# EAGLE design Full_Spectrum_TVP (EAGLE 9.6.2)
COMPANY: ADAFRUIT INDUSTRIES; DRAWN: KTOWN; REV: A
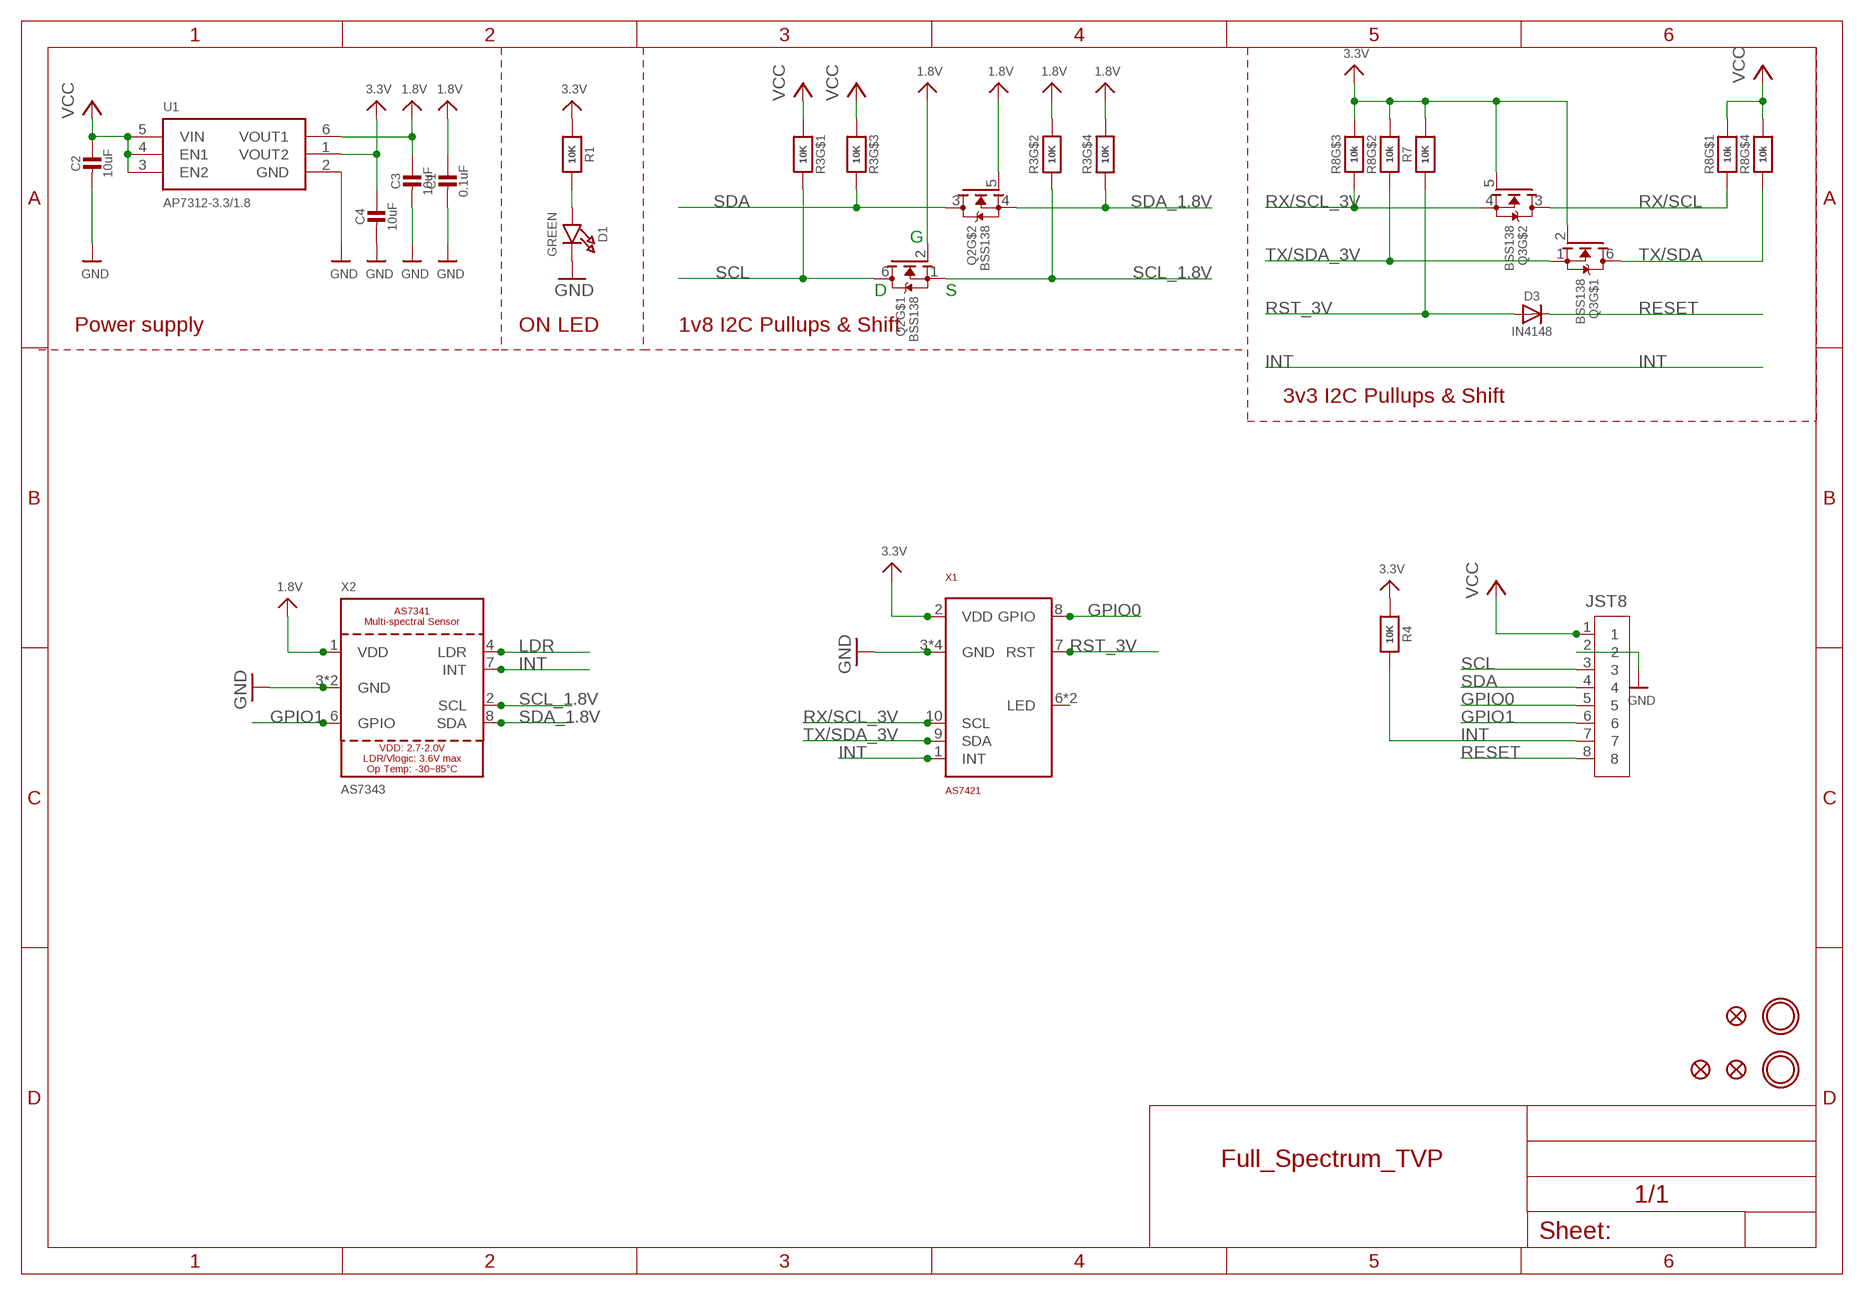
[diagram p0: schematic, sheet 1]

## Parts
C1  0.1uF  CAP_CERAMIC0603_NO  [0603-NO]
C2  10uF  CAP_CERAMIC0805-NOOUTLINE  [0805-NO]
C3  10uF  CAP_CERAMIC0805-NOOUTLINE  [0805-NO]
C4  10uF  CAP_CERAMIC0805-NOOUTLINE  [0805-NO]
D1  GREEN  LED0603_NOOUTLINE  [CHIPLED_0603_NOOUTLINE]
D3  IN4148  DIODESOD-323  [SOD-323]
FID1  FIDUCIAL_1MM  [FIDUCIAL_1MM]
FID3  FIDUCIAL_1MM  [FIDUCIAL_1MM]
FID4  FIDUCIAL_1MM  [FIDUCIAL_1MM]
Q2  BSS138  MOSFET-N_DUAL  [SOT363]
Q3  BSS138  MOSFET-N_DUAL  [SOT363]
R1  10K  RESISTOR_0603_NOOUT  [0603-NO]
R3  10K  RESISTOR_4PACK  [RESPACK_4X0603]
R4  10K  RESISTOR_0603_NOOUT  [0603-NO]
R7  10K  RESISTOR_0603_NOOUT  [0603-NO]
R8  10k  RESISTOR_4PACK_NO  [RESPACK_4X0603_NO]
SV1  JST8-2.0  [JST8-2.0]
U1  AP7312-3.3/1.8  VREG_SOT23-6_DUALAP7312  [SOT23-6]
U$1  MOUNTINGHOLE2.5  [MOUNTINGHOLE_2.5_PLATED]
U$17  MOUNTINGHOLE2.5  [MOUNTINGHOLE_2.5_PLATED]
X1  AS7421  [AS7421]
X2  AS7343  AS7341  [AS7341]

## Nets
1.8V [lowpower]: C1.1 C3.1 Q2.2(G) Q2.5(G) R3.2 R3.4 U1.6(VOUT1) X2.1(VDD)
3.3V: C4.1 Q3.2(G) Q3.5(G) R1.1 R4.1 R7.2 R8.6 R8.7 U1.1(VOUT2) X1.2(VDD)
GND [highpower]: C1.2 C2.2 C3.2 C4.2 D1.C SV1.2 U1.2(GND) X1.3(GND) X1.4(GND) X1.5(GND) X1.11(GND) X2.3(GND) X2.5(GND)
GPIO0: SV1.5 X1.8(GPIO)
GPIO1: SV1.6 X2.6(GPIO)
INT: R4.2 SV1.7 X1.1(INT) X2.7(INT)
LDR: X2.4(LDR)
N$1: D1.A R1.2
RESET: D3.C SV1.8
RST_3V: D3.A R7.1 X1.7(RST)
RX/SCL: Q3.3(D) R8.1
RX/SCL_3V: Q3.4(S) R8.3 X1.10(SCL)
SCL: Q2.6(D) R3.8 SV1.3
SCL_1.8V: Q2.1(S) R3.7 X2.2(SCL)
SDA: Q2.3(D) R3.6 SV1.4
SDA_1.8V: Q2.4(S) R3.5 X2.8(SDA)
TX/SDA: Q3.6(D) R8.4
TX/SDA_3V: Q3.1(S) R8.2 X1.9(SDA)
VCC [highpower]: C2.1 R3.1 R3.3 R8.5 R8.8 SV1.1 U1.3(EN2) U1.4(EN1) U1.5(VIN)
Unconnected: X1.6(LED) X1.12(LED)

## Notes on the sheet
- G
- D | S
- Power supply | ON LED | 1v8 I2C Pullups & Shift
- 3v3 I2C Pullups & Shift

## Library data of the parts
C1-C4 = microbuilder:CAP_CERAMIC: Ceramic Capacitors For new designs, use the packages preceded by an '_' character since they are more reliable: The following footprints should be used on most boards: _0402 - Standard footprint for regular board layouts _0603 - Standard footprint for regular board layouts _0805 - Standard footprint for regular board layouts _1206 - Standard footprint for regular board layouts For extremely tight-pitch boards where space is at a premium, the following 'micro-pitch' footprints can be used (smaller pads, no silkscreen outline, etc.): _0402MP - Micro-pitch footprint for very dense/compact boards _0603MP - Micro-pitch footprint for very dense/compact boards _0805MP - Micro-pitch footprint for very dense/compact boards _1206MP - Micro-pitch footprint for very dense/compact boards
D1 = microbuilder:LED: LED 0603 - 0603 Surface Mount Package 2mA: Green LED - Low Power (3.9mcd, 2ma, 1.7Vf) - Digikey: 475-2709-2-ND Orange LED - Low Power (9.8mcd, 2ma, 1.8Vf) - Digikey: 475-1194-2-ND Red LED - Low Power (5mcd, 2ma, 1.8Vf) - Digikey: 475-1195-2-ND Yellow LED - Low Power (7mcd, 2ma, 1.8Vf) - Digikey: 475-1196-2-ND 5mA: Blue LED - Low Power (17mcd, 5ma, 2.9Vf) - Digikey: LNJ937W8CRACT-ND 0805 - 0805 Surface Mount Package 2mA: Red LED (8.8mcd, 2mA, 1.8Vf, Clear) - Low Power [Digikey: 475-2510-1-ND] Green LED (5mcd, 2mA, 1.8Vf, Clear) - Low Power [Digikey: 475-2730-1-ND] Yellow LED (11.3mcd, 2mA, 1.8Vf, Clear) - Low Power [Digikey: 475-2555-1-ND] 20mA: Red LED (104mcd, 20mA, Diffused) - LS R976 [Digikey: 475-1278-6-ND] Red LED (12mcd, 20mA, 2.0Vf, Clear) - APT2012EC [Digikey: 754-1128-1-ND] Green LED (15mcd, 20mA, 2.2Vf, Clear) - APT2012GC [Digikey: 754-1131-1-ND] Orange LED (160mcd, 20mA, 2.1Vf, Clear) - APT2012SECK [Digikey: 754-1130-1-ND] 1206 - 1206 Surface Mount Package Green LED (26mcd, 20mA, Diffused) - LG N971 [Digikey: 475-1407-6-ND] Red LED (15mcd, 20mA, Diffused) - LH N974 [Digikey: 475-1416-6-ND] Cree - Cree High-Power Surface Mount LEDs XPEBWT-L1-0000-00D50 - White 111lm 350mA 2.9Vf 6200K 110° XTEAWT-00-0000-00000LEE3 - White 114lm 350mA 2.85Vf 5000K 115° Everlight - Everlight 45-21 Series Surface Mount LEDs 45-21/QK2C-B2832AC2CB2/2T - Warm White 2000mcd 20mA 3.25Vf 3050K 120° 45-21/LK2C-B38452C4CB2/2T - Nuetral White 2000mcd 20mA 3.25Vf 4150K 120° 45-21/LK2C-B50634C6CB2/2T - Cold White 2200mcd 20mA 3.25Vf 5650K 120° PLCC2 Reverse Mount LS T77K-J1L2-1-0-2-R18-Z - Red 11.25mcd 2mA 1.8Vf 630nm 120° LO T77K-L1M2-24-Z - Orange 19.6mcd 2mA 1.8Vf 606nm 120° LY T77K-K2M1-26-Z - Yellow 15.7mcd 2mA 1.8Vf 587nm 120°
D3 = microbuilder:DIODE: Diode SMA Model Volts Amps Type Vf Ir Digikey # Notes SSA34-E3 40V 3A Schottky 480mV @ 3A 200uA @ 40V SSA34-E3/61TGITR-ND CDBA120-G 20V 1A Schottky 500mV @ 1A 500uA @ 20V 641-1014-6-ND REEL MBRA210 10V 2A Schottky 350mV @ 2A 700uA @ 10V MBRA210LT3 SOD-123 Model Volts Amps Type Vf Ir Order # Notes BAT54T1G 30V 200mA Schottky 800mV @ 200mA 2uA @ 25V BAT54T1GOSTR-ND B0530W 30V 500mA Schottky 430mV @ 500mA 130uA @ 30V B0530W-FDICT-ND REEL MBR120 20V 1A Schottky 340mV @ 1A MBR120VLSFT1GOSCT-ND SOD-323 Model Volts Amps Type Vf Ir Order # Notes PMEG2005EJ 20V 500mA Schottky 355mV @ 500mA 568-4110-1-ND ZLLS410 10V 570mA Schottky 380mV @ 570mA ZLLS410CT-ND 1N4148WS 75V 150mA Silicon/Simple 1V 1N4148WSFSCT-ND REEL SOD-523 Model Volts Amps Type Vf Ir Order # Notes BAT54XV2 30V 200mA Schottky 0.8V @ 100mA BAT54XV2CT-ND TB751S 30V 30mA Schottky RB751S-40TE61CT-ND SOT23-R/W (R = Solder Paste/Reflow Ovens, W = Hand-Soldering) Model Volts Amps Type Vf Ir Order # Notes BAT54FILM 40V 300mA Schottky 497-7162-1-ND POWERDI-5 Model Volts Amps Type Vf Ir Order # Notes PDS560 60V 5A Schottky 670mV @ 5A 150uA @ 60V PDS560DICT-ND
FID1 FID3 FID4 = microbuilder:FIDUCIAL: Fiducial Alignment Points Various fiducial points for machine vision alignment.; BOM: EXCLUDE
Q2 Q3 = microbuilder:MOSFET-N_DUAL: Dual N-Channel MOSFET SOT363 (2.0x1.25mm) 2N7002PS - 60V, 320mA [Digikey: 568-5984-1-ND]
R1 R4 = microbuilder:RESISTOR: Resistors For new designs, use the packages preceded by an '_' character since they are more reliable: The following footprints should be used on most boards: _0402 - Standard footprint for regular board layouts _0603 - Standard footprint for regular board layouts _0805 - Standard footprint for regular board layouts _1206 - Standard footprint for regular board layouts For extremely tight-pitch boards where space is at a premium, the following 'micro-pitch' footprints can be used (smaller pads, no silkscreen outline, etc.): _0402MP - Micro-pitch footprint for very dense/compact boards _0603MP - Micro-pitch footprint for very dense/compact boards _0805MP - Micro-pitch footprint for very dense/compact boards _1206MP - Micro-pitch footprint for very dense/compact boards
R3 R8 = microbuilder:RESISTOR_4PACK: Resistor Packs (4 resistors) 4 x 0603 10K 1/16W - Digikey: YC164J-10KCT-ND
R7 = microbuilder_09_Nov_2015:RESISTOR: Resistors For new designs, use the packages preceded by an '_' character since they are more reliable: The following footprints should be used on most boards: _0402 - Standard footprint for regular board layouts _0603 - Standard footprint for regular board layouts _0805 - Standard footprint for regular board layouts _1206 - Standard footprint for regular board layouts For extremely tight-pitch boards where space is at a premium, the following 'micro-pitch' footprints can be used (smaller pads, no silkscreen outline, etc.): _0402MP - Micro-pitch footprint for very dense/compact boards _0603MP - Micro-pitch footprint for very dense/compact boards _0805MP - Micro-pitch footprint for very dense/compact boards _1206MP - Micro-pitch footprint for very dense/compact boards
SV1 = Connector_USB:JST8-2.0
U1 = adafruit_power:VREG_SOT23-6_DUAL: Dual Output SOT23-6 Linear Regulators Diodes Inc. AP7312 - Dual 150mA LDO Linear Regulator 0.2V dropout, 150mA output, 2-6V Input AP7312-1833W6-7 - 1.8V/3.3V SOT23-6 (Digikey: AP7312-1833W6-7DICT-ND) MIC5320 - Dual 150mA ULDO Linear Regulator Ultra-low 35mV dropout at 150mA, 2.3-5.5V Input 3.3V/1.8V SOT23-6 (Digikey: 576-1658-1-ND) 3.3V/1.5V SOT23-6 (Digikey: 576-3483-1-ND)
U$1 U$17 = microbuilder:MOUNTINGHOLE: Mounting Hole For #2 screws (0.086"/2.18mm width, 0.094"/2.4mm hole) use 2.5mm; BOM: EXCLUDE
X1 = Spectroscopy:AS7421
X2 = adafruit_sensor:AS7341

## Net classes
1 highpower: width 0.305 mm, drill 0.483 mm
2 lowpower: width 0.254 mm, drill 0.483 mm

## Board
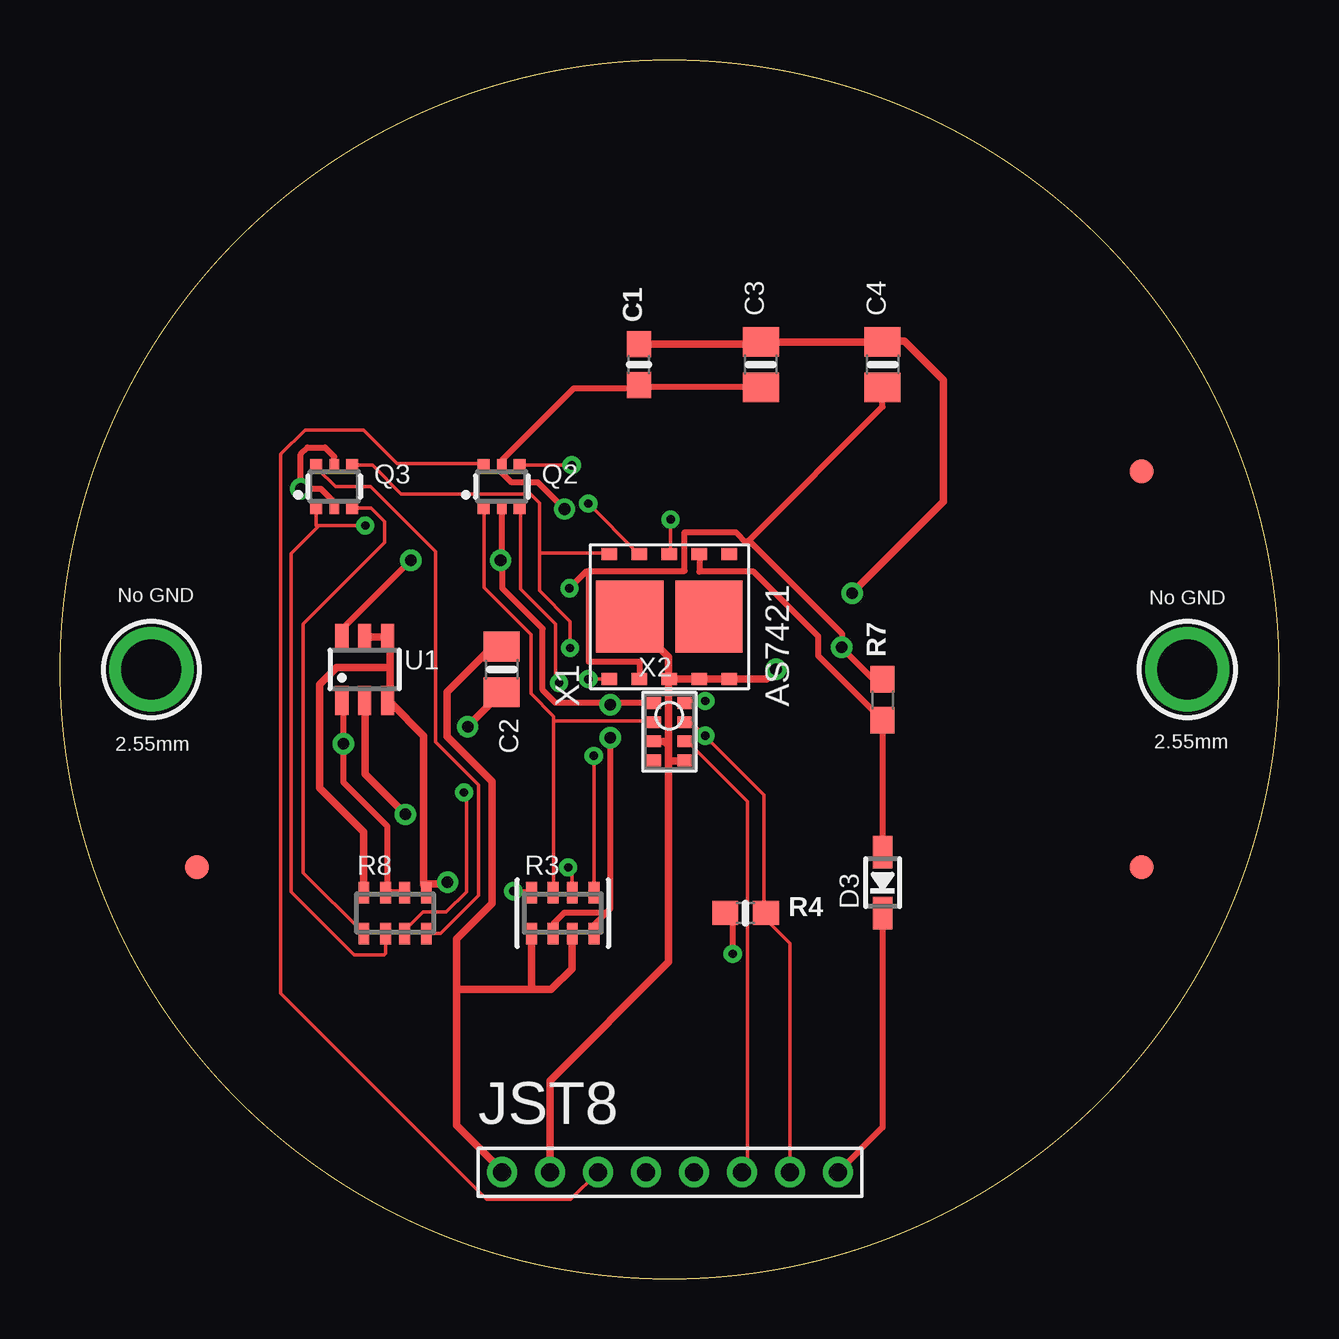
[diagram p1: board, top side]
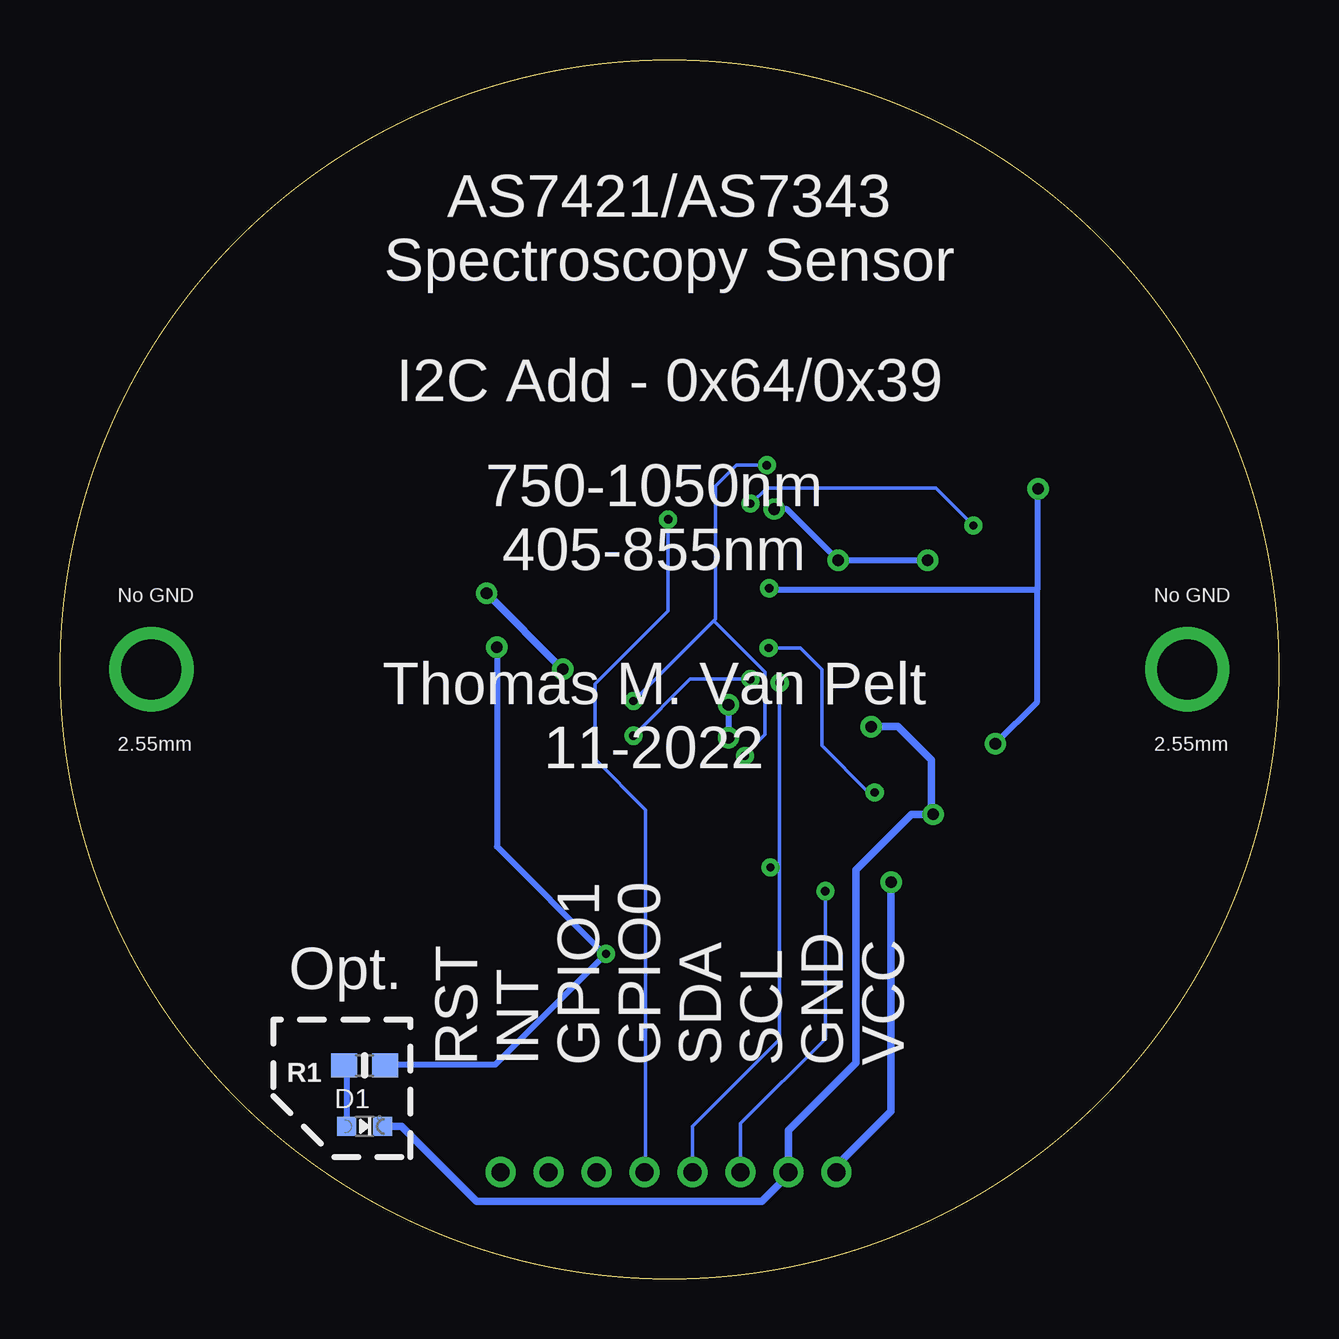
[diagram p2: board, bottom side, seen from below]

Size 50.8 x 50.8 mm. Coordinates in mm from the lower left corner, seen from the top.
Outline: circle at 25.4,25.4 radius 25.4
Copper layers (1*16): Top 0.035mm / dielectric 1.5mm / Bottom 0.035mm
Design rules "default": minimum track width 6mil, minimum drill 0.35mm, track to track 6mil, track to pad 6mil, pad to pad 6mil, via to via 6mil, smd to smd 6mil, copper to edge 40mil, drill to drill 6mil, minimum pad ring 10mil, minimum via ring 8mil, stop-mask expansion 4mil, vias tented up to drill 0mil, thermal gap 10mil

### Footprints (pad centres in the part's own frame; a part is rotated, then mirrored left to right if it is on the bottom)
0603-NO = smd 1.075 x 1: 1 -0.85,0; 2 0.85,0
0805-NO = smd 1.24 x 1.5: 1 -0.95,0; 2 0.95,0
CHIPLED_0603_NOOUTLINE = smd 0.8 x 0.8: A 0,-0.75; C 0,0.75
SOD-323 = smd 1.35 x 0.8: A 1.27,0; C -1.27,0
FIDUCIAL_1MM = smd 1 x 1: 1 0,0
SOT363 = smd 0.5 x 0.5: 1 -0.75,-0.9; 3 0.75,-0.9; 4 0.75,0.9; 6 -0.75,0.9 | smd 0.4 x 0.5: 2 0,-0.9; 5 0,0.9
RESPACK_4X0603 = smd 0.45 x 0.9: 1 -1.3,-0.85; 2 -0.4,-0.85; 3 0.4,-0.85; 4 1.3,-0.85; 5 1.3,0.85; 6 0.4,0.85; 7 -0.4,0.85; 8 -1.3,0.85
0603-NO' = smd 1.1 x 1: 1 -0.85,0; 2 0.85,0
RESPACK_4X0603_NO = smd 0.45 x 0.9: 1 -1.3,-0.85; 2 -0.4,-0.85; 3 0.4,-0.85; 4 1.3,-0.85; 5 1.3,0.85; 6 0.4,0.85; 7 -0.4,0.85; 8 -1.3,0.85
JST8-2.0 = drill 0.75: 1 0,7; 2 0,5; 3 0,3; 4 0,1; 5 0,-1; 6 0,-3; 7 0,-5; 8 0,-7
SOT23-6 = smd 0.55 x 1.2: 1 -0.95,-1.3; 2 0,-1.3; 3 0.95,-1.3; 4 0.95,1.3; 5 0,1.3; 6 -0.95,1.3
MOUNTINGHOLE_2.5_PLATED = drill 2.5 pad 3.2: P$1 0,0
AS7421 = smd 0.5 x 0.65: 1 -2.6,2.5; 2 -2.6,1.25; 3 -2.6,0; 4 -2.6,-1.25; 5 -2.6,-2.5; 6 2.6,-2.5; 7 2.6,-1.25; 8 2.6,0; 9 2.6,1.25; 10 2.6,2.5 | smd 3 x 2.8: 11 0,1.65; 12 0,-1.65
AS7341 = smd 0.575 x 0.488: 1 -0.635,1.2; 2 -0.635,0.4; 3 -0.635,-0.4; 4 -0.635,-1.2; 5 0.635,-1.2; 6 0.635,-0.4; 7 0.635,0.4; 8 0.635,1.2

### Placement (x,y rotation side)
C1  24.13,38.1 90 top
C2  18.41,25.4 270 top
C3  29.21,38.1 90 top
C4  34.29,38.1 90 top
D1  38.1,6.35 270 bottom
D3  34.29,16.51 90 top
FID1  45.09,17.14 0 top
FID3  5.71,17.14 0 top
FID4  45.09,33.66 0 top
Q2  18.41,33.02 0 top
Q3  11.43,33.02 0 top
R1  38.1,8.89 180 bottom
R3  20.95,15.24 0 top
R4  28.57,15.24 0 top
R7  10K  [0603-NO']  34.29,24.13 90 top
R8  13.97,15.24 0 top
SV1  25.43,4.45 90 top
U1  12.7,25.4 0 top
U$1  46.99,25.4 0 top
U$17  3.81,25.4 0 top
X1  25.4,27.6 90 top
X2  25.4,22.8 0 top

### Tracks (layer width: path | path; a pad name or v marks a point on that pad's centre or on a via)
1.8V  (via drill 0.48)
  Top 0.254: C3.1 29.18,37.19 24.38,37.19 C1.1 24,37.11 21.41,37.11 18.44,34.14 18.44,33.98 Q2.5 18.42,33.6 18.83,33.2 19.92,33.2 v21.03,32.08 | R3.2 20.57,14.4 20.57,14.81 21.03,15.26 22.74,15.26 22.76,15.24 | R3.4 22.25,14.4 22.25,14.63 22.2,14.68 22.76,15.24 | 22.94,24 X2.1 | 22.94,24 20.65,24 20.12,24.54 20.12,27.1 18.44,28.77 18.44,29.95 v18.36,29.95 18.41,30 Q2.2 | v14.63,29.95 11.81,27.13 11.81,26.75 U1.6 | 22.76,15.24 22.94,15.42 v22.94,22.55 | v22.94,23.93 22.94,24
  Bottom 0.254: v14.63,29.95 v18.36,29.95 20.5,32.08 v21.03,32.08 | v22.94,23.93 v22.94,22.55
3.3V  (via drill 0.35, 0.48)
  Top 0.152: R8.6 14.33,16.15 13.64,16.15 R8.7 13.64,16.23 | 11.81,24.08 U1.1 | 28.04,14.94 27.74,15.24 R4.1
  Top 0.254: 13.64,16.23 13.64,18.87 11.81,20.7 v11.81,22.3 11.81,24.08 | 28.04,14.94 v28.04,13.54 | R7.2 33.9,24.98 32.59,26.3 v32.59,26.31 32.59,26.91 32.58,26.91 28.71,30.77 | C4.1 34.29,36.35 28.71,30.77 | 28.71,30.77 28.61,30.67 28.17,31.11 26.04,31.11 26.04,29.5 26.03,29.5 22.05,29.5 | X1.2 24.15,25.72 22.05,25.72 22.05,29.5 | Q3.2 11.43,32.37 10.88,32.92 v10.03,32.92 10.03,34.37 10.31,34.65 11.05,34.65 11.43,34.27 Q3.5 | v21.23,28.78 21.95,29.5 21.95,29.39 22.05,29.5
  Bottom 0.152: 37.19,8.91 R1.1 | 28.12,13.54 v28.04,13.54
  Bottom 0.254: 10.07,28.73 10.07,24.04 v11.81,22.3 | v10.03,32.92 10.07,32.88 10.07,28.73 | 37.19,8.91 32.66,8.91 v28.04,13.54 | 28.12,13.54 32.59,18.01 v32.59,26.31 | 10.07,28.73 21.18,28.73 v21.23,28.78
GND  (via drill 0.48)
  Top 0.305: C4.2 34.14,39.09 34.29,39.09 | X1.3 25.45,24.99 26.59,24.99 X1.4 26.75,24.99 27.89,24.99 X1.5 29.45,25 v29.84,25.4 | 25.38,22.23 25.38,24.92 X1.3 | X1.3 25.38,25.15 25.38,25.91 23.7,27.58 X1.11 | v14.4,19.36 12.72,21.03 12.72,23.85 U1.2 | v16.99,23.01 18.36,24.38 C2.2 | v33.02,28.57 36.83,32.38 36.83,37.47 35.2,39.09 34.29,39.09 | 34.29,39.09 34.25,39.05 C3.2 29.11,38.95 C1.2 | 25.38,22.23 25.38,21.59 | X2.3 25.2,22.4 25.38,22.23 | X2.5 26.02,21.59 25.38,21.59 | SV1.2 20.43,8.26 25.38,13.2 25.38,21.59
  Bottom 0.305: D1.C 36.57,6.35 33.44,3.23 21.54,3.23 20.43,4.33 SV1.2 20.43,6.19 17.62,9 17.62,17.04 15.3,19.36 v14.4,19.36 14.48,19.43 14.48,21.62 15.87,23.01 v16.99,23.01 | v29.84,25.4 v33.02,28.57
GPIO0  (via drill 0.35)
  Top 0.152: v25.45,31.65 25.45,30.25 X1.8
  Bottom 0.152: v25.45,31.65 25.45,27.84 28.51,24.78 28.51,21.65 26.4,19.54 26.4,4.48 SV1.5
GPIO1
  Top 0.152: X2.6 26.06,22.33 26.21,22.33 28.65,19.89 28.65,4.67 SV1.6
INT  (via drill 0.35)
  Top 0.152: 26.88,22.62 29.34,20.16 29.34,15.32 | 26.88,22.62 26.36,23.14 26.09,23.14 26.06,23.16 X2.7 | 29.34,15.32 R4.2 | v22.02,24.99 22.86,24.99 X1.1 | 26.88,22.62 v26.9,22.63 | SV1.7 30.43,13.97 29.34,15.06 29.34,15.32
  Bottom 0.152: v22.02,24.99 24.54,24.99 v26.9,22.63
N$1
  Bottom 0.152: 38.86,8.76 38.94,8.84 R1.2 | 38.86,6.4 D1.A
  Bottom 0.254: 38.86,8.76 38.86,6.4
RESET
  Top 0.254: D3.C 34.29,6.3 SV1.8
RST_3V
  Top 0.254: D3.A R7.1 31.6,25.97 31.6,26.78 28.91,29.47 26.65,29.47 X1.7
RX/SCL
  Top 0.152: Q3.3 12.96,32.12 13.54,31.55 13.54,30.68 10.14,27.28 10.14,16.92 R8.1
RX/SCL_3V  (via drill 0.35)
  Top 0.152: Q3.4 12.19,33.91 13.03,33.91 14.23,32.71 19.61,32.71 19.98,32.34 19.98,30.2 | X1.10 22.86,30.25 20.04,30.25 19.98,30.2 | v16.84,20.27 16.94,20.17 16.94,16.13 16.1,15.29 15.14,15.29 14.4,14.55 14.4,14.4 R8.3 | v21.26,26.29 21.26,27.4 19.98,28.68 19.98,30.2
  Bottom 0.152: v16.84,20.27 17.09,20.27 19.05,22.23 19.05,25.4 19.94,26.29 v21.26,26.29
SCL  (via drill 0.35)
  Top 0.152: Q2.6 17.6,33.98 14.05,33.98 12.65,35.38 10.21,35.38 9.2,34.37 9.2,11.89 17.78,3.3 21.29,3.3 SV1.3 | v18.9,16.15 19.58,16.15 R3.8
  Bottom 0.152: v18.9,16.15 18.9,10 22.43,6.47 SV1.3
SCL_1.8V
  Top 0.152: Q2.1 17.68,32.08 17.68,28.8 19.64,26.85 19.64,24.38 20.57,23.45 20.57,23.2 | X2.2 24.77,23.24 20.61,23.24 20.57,23.2 | 20.57,23.2 20.57,16.15 R3.7
SDA  (via drill 0.35)
  Top 0.152: v20.8,24.84 20.65,24.99 20.65,27.3 19.2,28.75 19.2,32.08 Q2.3 | v21.18,17.14 21.34,16.99 21.34,16.15 R3.6
  Bottom 0.152: 20.8,17.14 v20.8,24.84 | 20.8,17.14 v21.18,17.14 | SV1.4 24.43,6.35 20.8,9.98 20.8,17.14
SDA_1.8V  (via drill 0.35)
  Top 0.152: v21.34,33.91 19.2,33.91 Q2.4 | v26.9,24.08 26.14,24.08 26.06,24 X2.8 | v22.25,21.79 22.25,16.15 R3.5
  Bottom 0.152: v21.34,33.91 22.61,33.91 23.48,33.04 23.48,27.5 23.58,27.4 | v22.25,21.79 22.31,21.79 21.41,22.69 21.41,25.3 23.51,27.4 23.58,27.4 | v26.9,24.08 23.58,27.4
TX/SDA
  Top 0.152: Q3.6 10.74,33.91 10.74,33.76 11.49,33.01 12.95,33.01 15.65,30.32 15.65,22.37 17.45,20.57 17.45,15.98 15.87,14.4 15.32,14.4 R8.4
TX/SDA_3V  (via drill 0.35)
  Top 0.152: Q3.1 10.67,32.08 10.67,31.39 10.79,31.39 | v22.02,32.31 24.08,30.25 X1.9 | 10.79,31.39 v12.72,31.39 | 10.79,31.39 9.63,30.23 9.63,16.12 12.26,13.5 13.5,13.5 13.57,13.57 R8.2
  Bottom 0.152: v22.02,32.31 21.99,32.31 21.34,32.97 14.3,32.97 v12.72,31.39
VCC  (via drill 0.48)
  Top 0.305: 13.75,25.47 13.75,26.62 U1.4 13.56,26.75 12.88,26.75 U1.5 | 13.75,25.47 13.75,24.12 U1.3 13.79,24 15.16,22.63 15.16,16.46 | R8.8 12.65,16.15 12.65,18.62 10.82,20.45 10.82,24.77 11.53,25.47 13.75,25.47 | 15.16,16.46 R8.5 | 19.7,12.06 20.48,12.06 21.34,12.92 21.34,14.33 R3.3 | 19.7,12.06 18.77,12.06 16.54,12.06 | C2.1 18.02,26.35 16.13,24.45 16.13,22.6 18.01,20.72 18.01,15.65 16.54,14.17 16.54,12.06 | v16.15,16.54 16.08,16.46 15.16,16.46 | 16.54,12.06 16.54,6.4 18.43,4.51 SV1.1 | R3.1 19.66,12.11 19.7,12.06
  Bottom 0.305: v16.15,16.54 16.15,6.99 18.43,4.71 SV1.1

### Text on the board
tNames: No GND | No GND | 2.55mm | 2.55mm
bNames: AS7421/AS7343 / Spectroscopy Sensor | I2C Add - 0x64/0x39 | 750-1050nm / 405-855nm | No GND | No GND | Thomas M. Van Pelt / 11-2022 | 2.55mm | 2.55mm | Opt. | VCC | GND | SCL | SDA | GPIO0 | GPIO1 | INT | RST